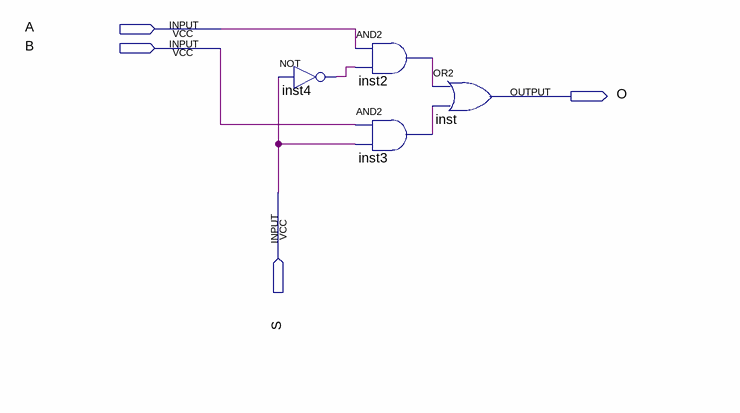
[diagram p0: schematic sheet]
// Quartus schematic mux_2x1_1bit.bdf as structural Verilog: 4 symbols, 4 pins
module mux_2x1_1bit (
  input  A,
  input  B,
  input  S,
  output O
);

  wire inst2_out, inst3_out, inst4_out;

  not inst4 (inst4_out, S);
  and inst2 (inst2_out, A, inst4_out);
  and inst3 (inst3_out, B, S);
  or inst (O, inst2_out, inst3_out);
endmodule
